# EAGLE design Schematic (EAGLE 9.1.3)
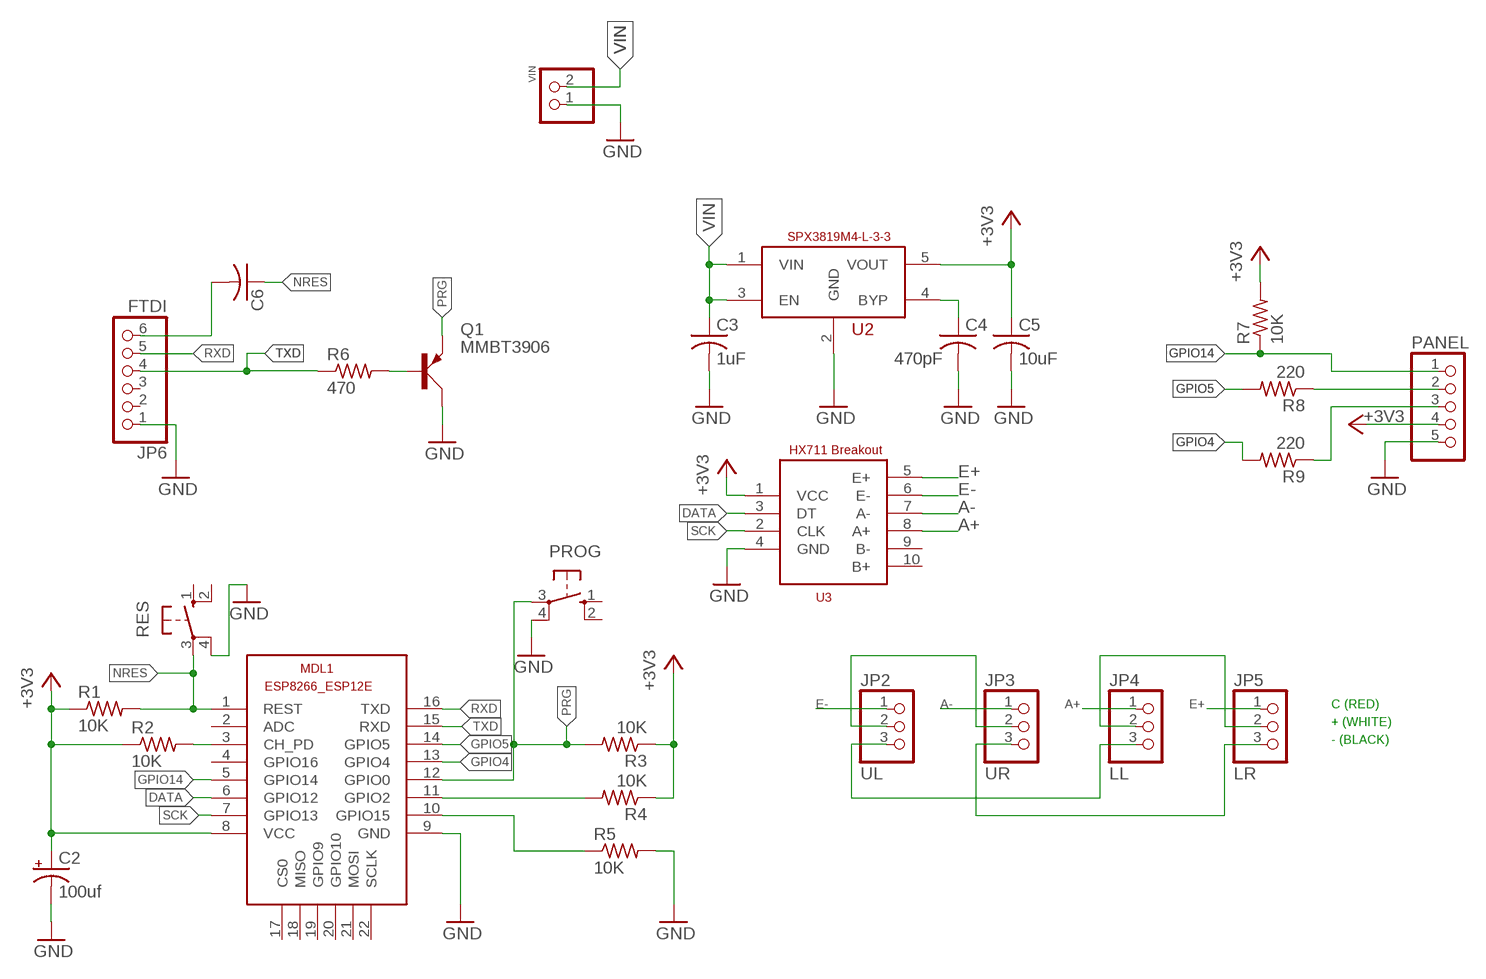
[diagram p0: schematic, sheet 1]

## Parts
C2  100uf  CPOL-USE2,5-6E  [E2,5-6E]
C3  1uF  C-USC0805  [C0805]
C4  470pF  C-USC0805  [C0805]
C5  10uF  C-USC0805  [C0805]
C6  100uF  C-US025-024X044  [C025-024X044]
JP2  UL  PINHD-1X3  [1X03]
JP3  UR  PINHD-1X3  [1X03]
JP4  LL  PINHD-1X3  [1X03]
JP5  LR  PINHD-1X3  [1X03]
JP6  FTDI  PINHD-1X6  [1X06]
MDL1  ESP8266-12EESP8266-ESP12E  [ESP8266-ESP12E]
PANEL  PINHD-1X5  [1X05]
PROG  10-XX  [B3F-10XX]
Q1  MMBT3906  2N3906  [TO92D]
R1  10K  R-US_R0805  [R0805]
R2  10K  R-US_R0805  [R0805]
R3  10K  R-US_R0805  [R0805]
R4  10K  R-US_R0805  [R0805]
R5  10K  R-US_R0805  [R0805]
R6  470  R-US_R0805  [R0805]
R7  10K  R-US_R0805  [R0805]
R8  220  R-US_R0805  [R0805]
R9  220  R-US_R0805  [R0805]
RES  10-XX  [B3F-10XX]
U2  SPX3819M5-L-3-3  [SOT23-5L]
U3  HX711-BREAKOUT  [HX711-THT]
VIN  PINHD-1X2  [1X02]

## Nets
+3V3: C2.+ C5.1 MDL1.8(VCC) PANEL.4 R1.1 R2.1 R3.1 R4.1 R7.2 U2.5(VOUT) U3.1(VCC)
A+: JP4.1 U3.8(A+)
A-: JP3.1 U3.7(A-)
DATA: MDL1.6(GPIO12) U3.3(DT)
DTR: C6.2 JP6.6
E+: JP5.1 U3.5(E+)
E-: JP2.1 U3.6(E-)
GND: C2.- C3.2 C4.2 C5.2 JP6.1 MDL1.9(GND) PANEL.5 PROG.4(P1) Q1.C R5.2 RES.4(P1) U2.2(GND) U3.4(GND) VIN.1
GPIO4: MDL1.13(GPIO4) R9.2
GPIO5: MDL1.14(GPIO5) R8.2
GPIO14: MDL1.5(GPIO14) PANEL.1 R7.1
N$1: Q1.B R6.2
N$2: MDL1.3(CH_PD) R2.2
N$3: MDL1.10(GPIO15) R5.1
N$4: MDL1.11(GPIO2) R4.2
N$6: JP2.3 JP4.3
N$7: JP3.3 JP5.3
N$8: JP2.2 JP3.2
N$9: JP4.2 JP5.2
N$10: C4.1 U2.4(BYP)
N$13: PANEL.2 R8.1
N$14: PANEL.3 R9.1
NRES: C6.1 MDL1.1(REST) R1.2 RES.3(P)
PRG: MDL1.12(GPIO0) PROG.3(P) Q1.E R3.2
RXD: JP6.5 MDL1.16(TXD)
SCK: MDL1.7(GPIO13) U3.2(CLK)
TXD: JP6.4 MDL1.15(RXD) R6.1
VIN: C3.1 U2.1(VIN) U2.3(EN) VIN.2
Unconnected: JP6.2 JP6.3 MDL1.2(ADC) MDL1.4(GPIO16) MDL1.17(CS0) MDL1.18(MISO) MDL1.19(GPIO9) MDL1.20(GPIO10) MDL1.21(MOSI) MDL1.22(SCLK) PROG.1(S) PROG.2(S1) RES.1(S) RES.2(S1) U3.9(B-) U3.10(B+)

## Notes on the sheet
- C (RED)
- + (WHITE)
- - (BLACK)

## Library data of the parts
C2 = rcl:CPOL-US: POLARIZED CAPACITOR, American symbol; SPICEPREFIX: C
C3-C6 = rcl:C-US: CAPACITOR, American symbol; SPICEPREFIX: C
JP2-JP5 = pinhead:PINHD-1X3: PIN HEADER
JP6 = pinhead:PINHD-1X6: PIN HEADER
MDL1 = ESP8266-ESP12E:ESP8266-12E: ESP8266-12E with additional I/O and GPIO04/05 corrected The author cannot warrant that this library is free from error or will meet your specific requirements. Created by PuceBaboon.com. Komagane, Nagano, JAPAN
PANEL = pinhead:PINHD-1X5: PIN HEADER
PROG RES = switch-omron:10-XX: OMRON SWITCH; MPN: B3F-1000; OC_FARNELL: 176432; OC_NEWARK: 36M3542
Q1 = transistor-small-signal:2N3906: PNP TRANSISTOR
R1-R5 R7-R9 = resistor:R-US_: RESISTOR, American symbol
R6 = rcl:R-US_: RESISTOR, American symbol; SPICEPREFIX: R
U2 = Dans-Library:SPX3819M5-L-3-3
U3 = HX711-Breakout:HX711-BREAKOUT
VIN = pinhead:PINHD-1X2: PIN HEADER

## Board
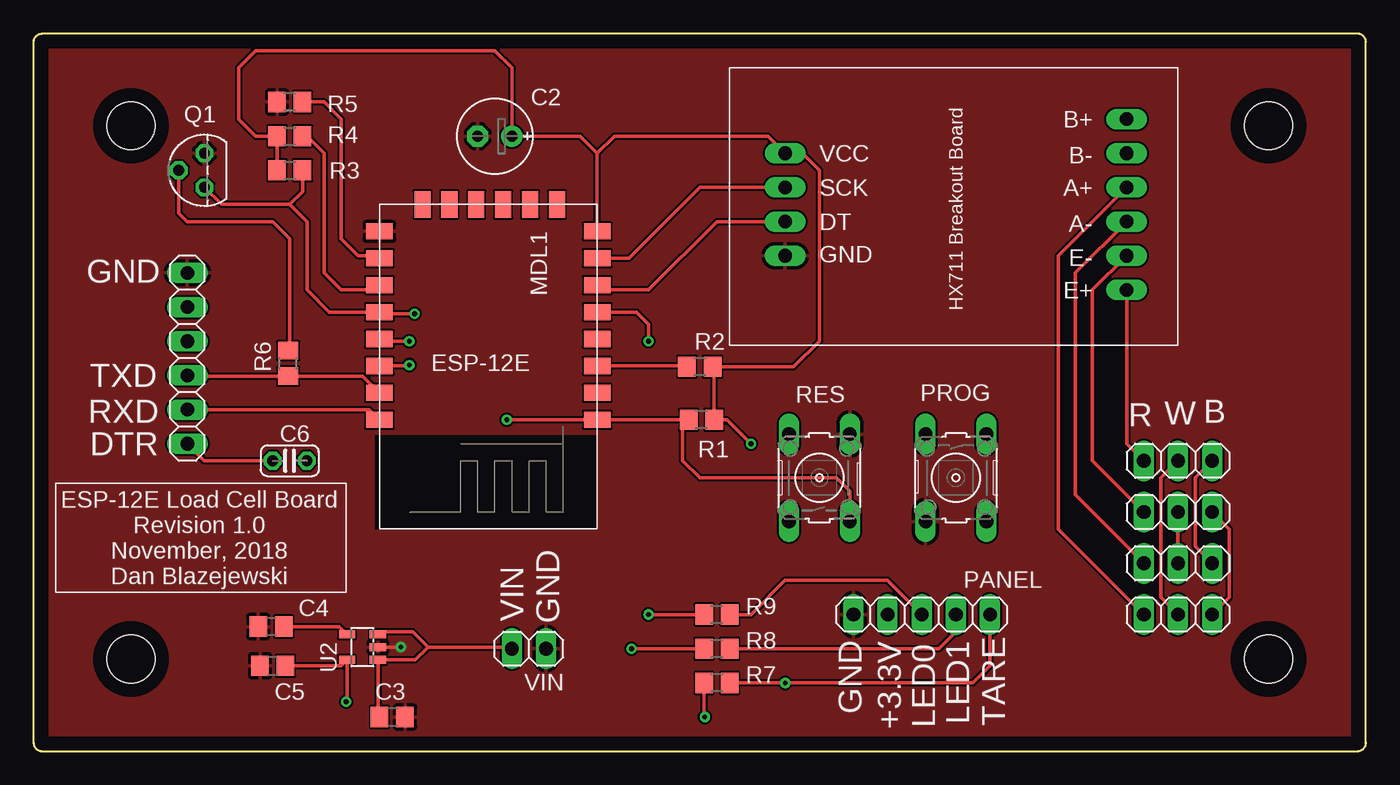
[diagram p1: board, top side]
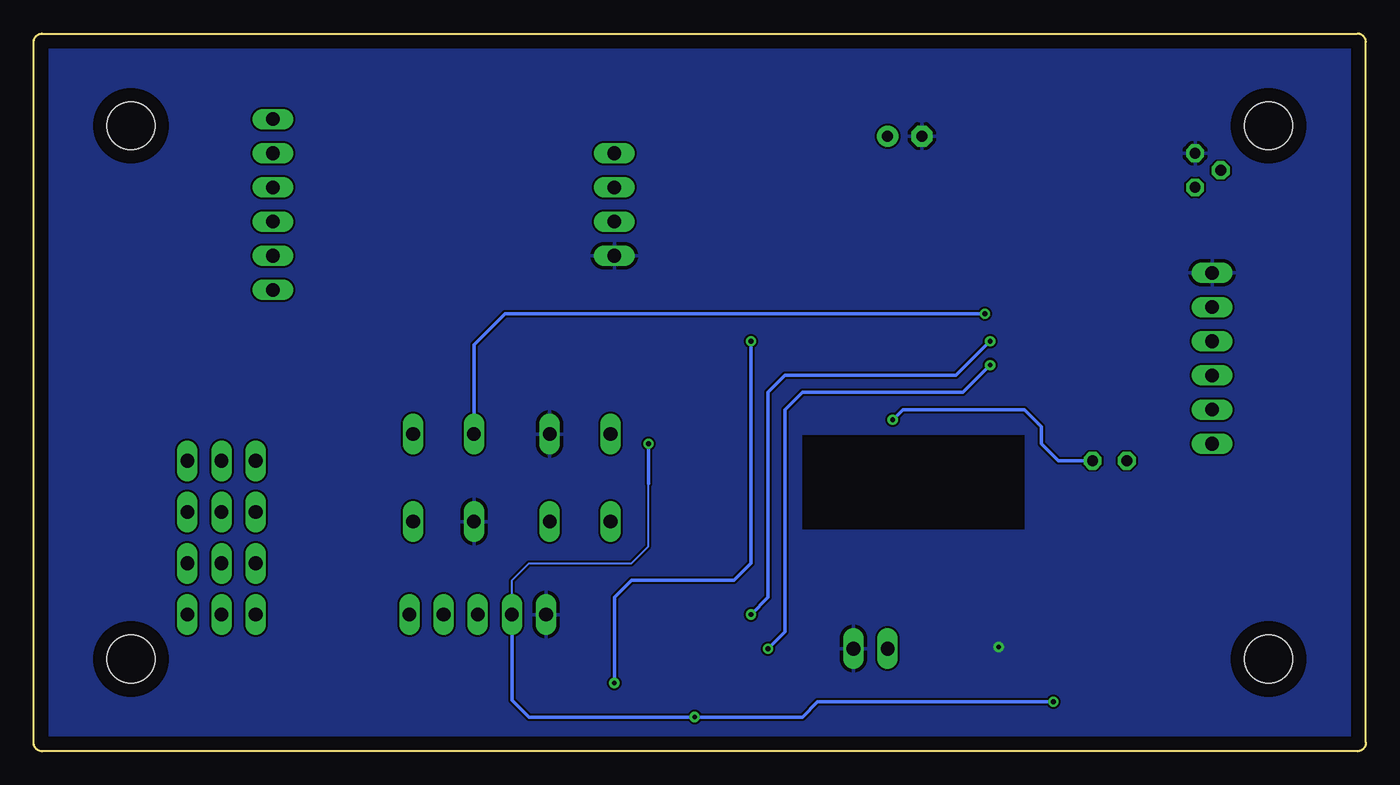
[diagram p2: board, bottom side, seen from below]

Size 99.06 x 53.34 mm. Coordinates in mm from the lower left corner, seen from the top.
Outline: 0,0.64 0,52.7 arc-90 0.64,53.34 98.42,53.34 arc-90 99.06,52.7 99.06,0.64 arc-90 98.42,0 0.64,0 arc-90 0,0.64
Copper layers (1*16): Top 0.035mm / dielectric 1.5mm / Bottom 0.035mm
Design rules "default": minimum track width 6mil, minimum drill 0.35mm, track to track 6mil, track to pad 6mil, pad to pad 6mil, via to via 6mil, smd to smd 6mil, copper to edge 40mil, drill to drill 6mil, minimum pad ring 10mil, minimum via ring 8mil, stop-mask expansion 4mil, vias tented up to drill 0mil, thermal gap 10mil
Holes 3.56 mm at 7.24,6.86 91.82,6.86 7.24,46.48 91.82,46.48

### Footprints (pad centres in the part's own frame; a part is rotated, then mirrored left to right if it is on the bottom)
E2,5-6E = drill 0.813 pad 1.575: + -1.27,0 | drill 0.813 pad 1.575 octagon: - 1.27,0
C0805 = smd 1.3 x 1.5: 1 -0.95,0; 2 0.95,0
C025-024X044 = drill 0.813 octagon: 1 -1.27,0; 2 1.27,0
1X03 = drill 1.016 long: 1 -2.54,0; 2 0,0; 3 2.54,0
1X06 = drill 1.016 long: 1 -6.35,0; 2 -3.81,0; 3 -1.27,0; 4 1.27,0; 5 3.81,0; 6 6.35,0
ESP8266-ESP12E = smd 2 x 1.2: 1 -7.62,5.84; 2 -7.62,3.84; 3 -7.62,1.84; 4 -7.62,-0.16; 5 -7.62,-2.16; 6 -7.62,-4.16; 7 -7.62,-6.16; 8 -7.62,-8.16; 9 8.58,-8.16; 10 8.58,-6.16; 11 8.58,-4.16; 12 8.58,-2.16; 13 8.58,-0.16; 14 8.58,1.84; 15 8.58,3.84; 16 8.58,5.84 | smd 1.2 x 2: 17 -4.62,-10.16; 18 -2.62,-10.16; 19 -0.62,-10.16; 20 1.38,-10.16; 21 3.38,-10.16; 22 5.38,-10.16
1X05 = drill 1.016 long: 1 -5.08,0; 2 -2.54,0; 3 0,0; 4 2.54,0; 5 5.08,0
B3F-10XX = drill 1.016 long: 1 -3.251,2.261; 2 3.251,2.261; 3 -3.251,-2.261; 4 3.251,-2.261
TO92D = drill 0.813 octagon: B 0,1.905; C 1.27,0; E -1.27,0
R0805 = smd 1.3 x 1.5: 1 -0.95,0; 2 0.95,0
SOT23-5L = smd 0.6 x 1.2: 1 -0.95,-1.15; 2 0,-1.15; 3 0.95,-1.15; 4 0.95,1.15; 5 -0.95,1.15
HX711-THT = drill 1.016 long: 1 13.97,-2.54; 2 13.97,0; 3 13.97,2.54; 4 13.97,5.08; 5 -11.43,7.62; 6 -11.43,5.08; 7 -11.43,2.54; 8 -11.43,0; 9 -11.43,-2.54; 10 -11.43,-5.08
1X02 = drill 1.016 long: 1 -1.27,0; 2 1.27,0

### Placement (x,y rotation side)
C2  34.29,45.72 180 top
C3  26.67,2.54 0 top
C4  17.65,9.27 180 top
C5  17.78,6.35 180 top
C6  19.05,21.59 180 top
JP2  85.09,17.78 0 top
JP3  85.09,13.97 0 top
JP4  85.09,10.16 0 top
JP5  85.09,21.59 0 top
JP6  11.43,29.21 270 top
MDL1  34.29,30.48 180 top
PANEL  66.04,10.16 180 top
PROG  68.58,20.32 270 top
Q1  12.7,43.18 90 top
R1  49.66,24.64 180 top
R2  49.53,28.57 180 top
R3  19.05,43.18 0 top
R4  19.05,45.72 0 top
R5  19.05,48.26 180 top
R6  18.92,28.83 90 top
R7  50.8,5.08 180 top
R8  50.8,7.62 180 top
R9  50.8,10.16 180 top
RES  58.42,20.32 90 top
U2  24.45,7.74 90 top
U3  69.85,41.91 180 top
VIN  36.83,7.62 180 top

### Tracks (layer width: path | path; a pad name or v marks a point on that pad's centre or on a via)
+3V3  (via drill 0.35)
  Top 0.254: C5.1 22.86,6.35 U2.5 23.3,3.74 v23.24,3.68 | v49.91,2.54 49.85,2.6 R7.2 | R3.1 R4.1 16.51,45.72 15.24,46.99 15.24,50.8 16.51,52.07 34.29,52.07 35.56,50.8 C2.+ 40.64,45.72 41.91,44.45 | v53.34,22.86 51.56,24.64 R1.1 50.61,28.45 R2.1 56.52,28.57 58.42,30.48 58.42,43.18 57.15,44.45 U3.1 54.61,45.72 43.18,45.72 41.91,44.45 | MDL1.8 41.91,44.45
  Bottom 0.152: 53.34,19.89 53.34,15.24 54.61,13.97 62.23,13.97 63.5,12.7 PANEL.4
  Bottom 0.254: PANEL.4 63.5,3.81 62.23,2.54 v49.91,2.54 41.91,2.54 40.77,3.68 v23.24,3.68 | 53.34,19.89 v53.34,22.86
A+
  Top 0.254: JP4.1 76.2,16.51 76.2,36.83 U3.8
A-
  Top 0.254: JP3.1 77.47,19.05 77.47,35.56 U3.7
DATA
  Top 0.254: MDL1.6 42.26,34.29 45.72,34.29 50.8,39.37 U3.3
DTR
  Top 0.254: JP6.6 12.7,21.59 C6.2
E+
  Top 0.254: JP5.1 81.28,22.86 U3.5
E-
  Top 0.254: JP2.1 78.74,21.59 78.74,34.29 U3.6
GND  (via drill 0.35)
  Top 0.254: U2.2 27.17,7.74 27.18,7.75 v27.3,7.75
  pour Bottom: 0,0.64 0,52.7 arc-90 0.64,53.34 98.42,53.34 arc-90 99.06,52.7 99.06,0.64 arc-90 98.42,0 0.64,0 arc-90
  pour Top: 0,0.64 0,52.7 arc-90 0.64,53.34 98.42,53.34 arc-90 99.06,52.7 99.06,0.64 arc-90 98.42,0 0.64,0 arc-90
GPIO4  (via drill 0.35)
  Top 0.254: MDL1.13 25.87,30.48 v27.94,30.48 | v45.72,10.16 R9.2
  Bottom 0.254: v27.94,30.48 30.48,27.94 43.18,27.94 44.45,26.67 44.45,11.43 v45.72,10.16
GPIO5  (via drill 0.35)
  Top 0.254: MDL1.14 27.88,28.64 27.94,28.57 v27.94,28.7 | v44.45,7.62 R8.2
  Bottom 0.254: v27.94,28.7 29.97,26.67 41.91,26.67 43.18,25.4 43.18,8.89 v44.45,7.62
GPIO14  (via drill 0.35)
  Top 0.254: R7.1 v55.88,5.08 69.85,5.08 71.12,6.35 PANEL.1 | MDL1.5 44.83,32.64 45.72,31.75 v45.72,30.48
  Bottom 0.254: v45.72,30.48 45.72,13.97 46.99,12.7 54.61,12.7 55.88,11.43 v55.88,5.08
N$1
  Top 0.254: Q1.B 10.79,40.01 11.43,39.37 17.78,39.37 19.05,38.1 19.05,29.91 R6.2
N$2
  Top 0.254: MDL1.3 48.52,28.64 R2.2
N$3
  Top 0.254: MDL1.10 25.52,36.83 | 25.52,36.83 MDL1.10 | MDL1.10 25.52,36.83 | 25.52,36.83 24.13,36.83 22.86,38.1 22.86,46.99 21.59,48.26 R5.1
N$4
  Top 0.254: MDL1.11 25.36,34.29 22.86,34.29 21.59,35.56 21.59,44.45 20.32,45.72 R4.2
N$6
  Top 0.254: JP2.3 88.9,16.51 88.9,11.43 JP4.3
N$7
  Top 0.254: JP5.3 86.36,20.32 86.36,15.24 JP3.3
N$8
  Top 0.254: JP2.2 JP3.2
N$9
  Top 0.254: JP5.2 83.82,20.32 83.82,11.43 JP4.2
N$10
  Top 0.254: C4.1 22.72,9.27 U2.4
N$13
  Top 0.254: R8.1 67.31,7.62 68.58,8.89 PANEL.2
N$14
  Top 0.254: R9.1 53.34,10.16 55.88,12.7 63.5,12.7 PANEL.3
NRES  (via drill 0.35)
  Top 0.254: 48.26,24.64 MDL1.1 v35.18,24.64 | 48.26,24.64 R1.2 | RES.3 60.68,19.33 59.69,20.32 49.53,20.32 48.26,21.59 48.26,24.64
  Bottom 0.254: v35.18,24.64 34.42,25.4 25.4,25.4 24.13,24.13 24.13,22.86 22.86,21.59 C6.1
PRG  (via drill 0.35)
  Top 0.254: 25.65,32.64 21.97,32.64 20.32,34.29 20.32,39.37 19.05,40.64 | 25.65,32.64 MDL1.12 | Q1.E 13.97,40.64 19.05,40.64 | 19.05,40.64 | R3.2 20,41.59 19.05,40.64 | v28.32,32.51 26.42,32.51 26.16,32.26 25.78,32.64 25.65,32.64
  Bottom 0.254: PROG.3 66.32,30.2 64.01,32.51 v28.32,32.51
RXD
  Top 0.254: JP6.5 24.95,25.4 MDL1.16
SCK
  Top 0.254: MDL1.7 44.26,36.64 45.72,38.1 | U3.2 49.53,41.91 45.72,38.1 | 45.72,38.1
TXD
  Top 0.254: MDL1.15 24.47,27.88 R6.1 11.49,27.88 JP6.4
VIN
  Top 0.254: U2.3 25.8,8.89 28.19,8.89 29.34,7.75 | 29.34,7.75 29.21,7.62 | 29.21,7.62 28.38,6.79 U2.1 25.6,2.66 C3.1 | 29.21,7.62 | 29.34,7.75 35.43,7.75 VIN.2

### Text on the board
tPlace: GND | TXD | RXD | R | W | B | DTR | ESP-12E Load Cell Board / Revision 1.0 / November, 2018 / Dan Blazejewski | VIN | GND | GND | +3.3V | LED0 | LED1 | TARE